# Altium schematic sheet ESC_PCB.SchDoc: BLDC ESC v2
size A; Author: Roel Uytterhoeven
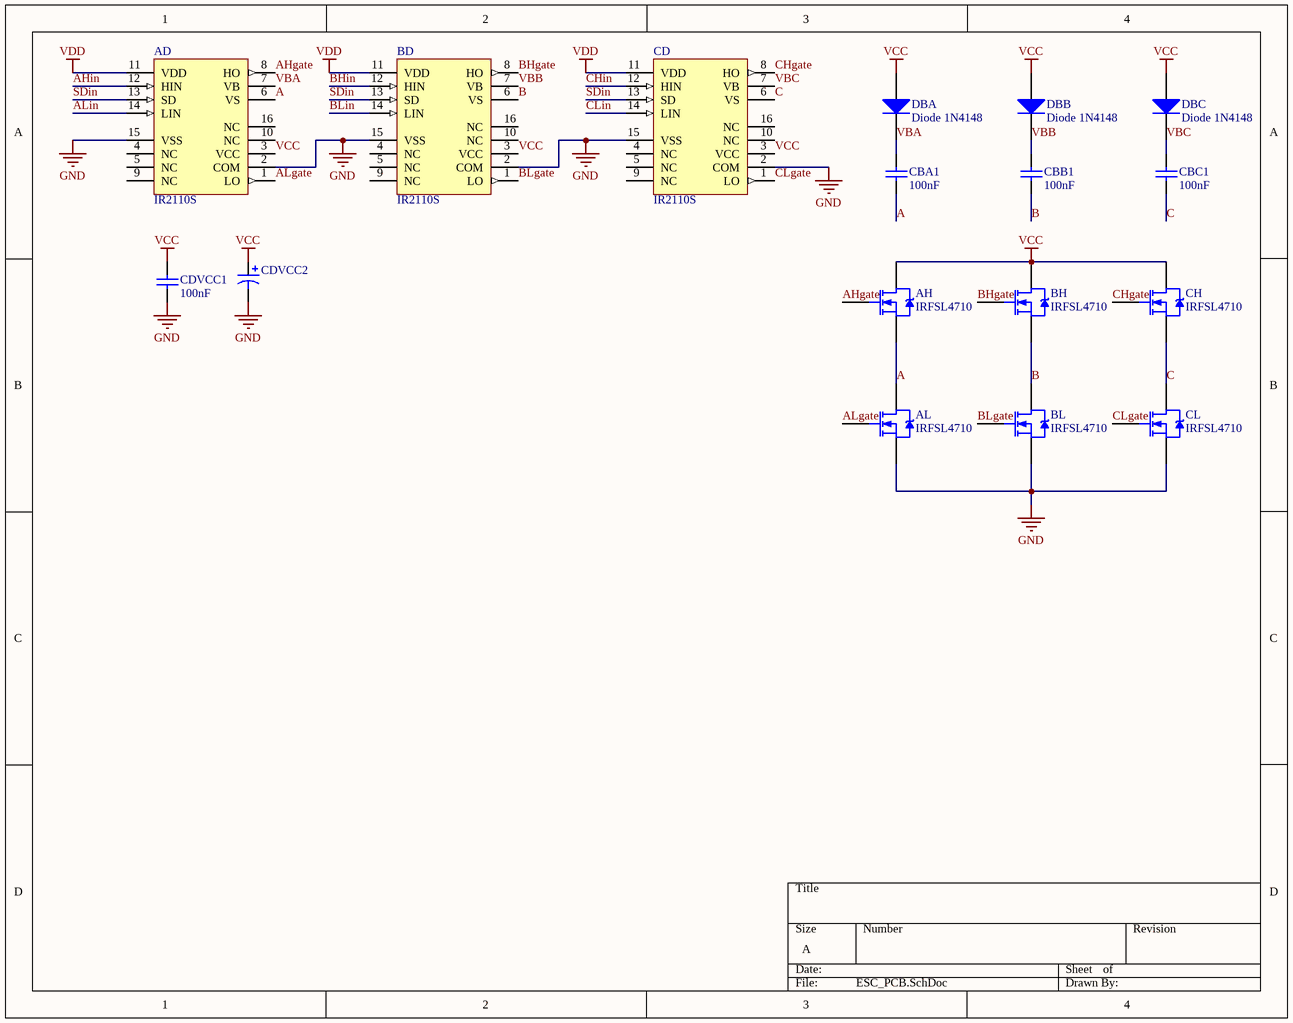
[diagram p0: ESC_PCB.SchDoc]

## Parts
AD  IR2110S  [SOIC16_N]
AH  IRFSL4710  [TO-262]
AL  IRFSL4710  [TO-262]
BD  IR2110S  [SOIC16_N]
BH  IRFSL4710  [TO-262]
BL  IRFSL4710  [TO-262]
CBA1  100nF  [VP31-2.5]
CBB1  100nF  [VP31-2.5]
CBC1  100nF  [VP31-2.5]
CD  IR2110S  [SOIC16_N]
CDVCC1  100nF  [VP31-2.5]
CDVCC2  EKF00MP133J00  [CAPPR2-5X5]  (value not drawn)
CH  IRFSL4710  [TO-262]
CL  IRFSL4710  [TO-262]
DBA  Diode 1N4148  [DO-35]
DBB  Diode 1N4148  [DO-35]
DBC  Diode 1N4148  [DO-35]

## Nets
GND: AD.2(COM) AD.15(VSS) AL.3(S) BD.2(COM) BD.15(VSS) BL.3(S) CD.2(COM) CD.15(VSS) CDVCC1.1 CDVCC2.2 CL.3(S)
VCC: AD.3(VCC) AH.2(D) BD.3(VCC) BH.2(D) CD.3(VCC) CDVCC1.2 CDVCC2.1 CH.2(D) DBA.1(A) DBB.1(A) DBC.1(A)
VDD: AD.11(VDD) BD.11(VDD) CD.11(VDD)
A: AD.6(VS) AH.3(S) AL.2(D) CBA1.1
AHgate: AD.8(HO) AH.1(G)
AHin: AD.12(HIN)
ALgate: AD.1(LO) AL.1(G)
ALin: AD.14(LIN)
B: BD.6(VS) BH.3(S) BL.2(D) CBB1.1
BHgate: BD.8(HO) BH.1(G)
BHin: BD.12(HIN)
BLgate: BD.1(LO) BL.1(G)
BLin: BD.14(LIN)
C: CBC1.1 CD.6(VS) CH.3(S) CL.2(D)
CHgate: CD.8(HO) CH.1(G)
CHin: CD.12(HIN)
CLgate: CD.1(LO) CL.1(G)
CLin: CD.14(LIN)
SDin: AD.13(SD) BD.13(SD) CD.13(SD)
VBA: AD.7(VB) CBA1.2 DBA.2(K)
VBB: BD.7(VB) CBB1.2 DBB.2(K)
VBC: CBC1.2 CD.7(VB) DBC.2(K)

Not connected (* = marked no-connect by the designer): AD 4(NC) 5(NC) 9(NC) 10(NC) 16(NC); BD 4(NC) 5(NC) 9(NC) 10(NC) 16(NC); CD 4(NC) 5(NC) 9(NC) 10(NC) 16(NC)

## Library data of the parts
AD BD CD = IR2110S: High and Low Side Driver; Note: Pins 4, 5, 9, 10 and 16 are not connected; Published: 8-Jun-2000; LatestRevisionDate: 13-Apr-2006; LatestRevisionNote: IPC-7351 Footprint Added.; DatasheetVersion: PD60147J; PackageReference: SOIC16; Publisher: Altium Limited; PackageDescription: 16-Pin Small Outline Integrated Circuit 1.27 mm Pitch; Code_JEDEC: MS-013-AA; Code_IPC: SOIC127P1030-16; ComponentLink1Description: Manufacturer Link; ComponentLink1URL: http://www.irf.com/; ComponentLink2Description: Datasheet; ComponentLink2URL: http://www.irf.com/product-info/datasheets/data/ir2110.pdf
AH AL BH BL CH CL = IRFSL4710: HEXFET Power MOSFET; Note: Pin 2 is electrically connected to Tab (Drain).; Published: 17-Sep-2003; DatasheetVersion: 16-Mar-2001; PackageReference: TO-262; Publisher: Altium Limited; PackageDescription: TO, Thru-Hole, Vertical, Heatsink Mounted; 3 In-Line Leads; Pitch 2.54 mm; ComponentLink1Description: Manufacturer Link; ComponentLink1URL: http://www.irf.com/; ComponentLink2Description: Datasheet; ComponentLink2URL: http://www.irf.com/product-info/datasheets/data/IRFR24N15D.pdf
CBA1 CBB1 CBC1 CDVCC1 = VP31BY103: Dipped Radial Multilayer Ceramic Capacitor X7R: 10nF; Note: See Datasheet for other packages & tolerances; Published: 17-Dec-2003; DatasheetDocument: 4-Feb-2002; PackageDocument: 4-Feb-2002; PackageReference: VP31-2.5; Publisher: Altium Limited; ComponentLink1Description: Manufacturer Link; ComponentLink1URL: http://www.vishay.com/; Value: 10nF
CDVCC2 = EKF00MP133J00: Aluminum Electrolytic Capacitor, Radial Style with Long Leads: 3.3uF, 63V; Note: Refer to Manufacturer's Data Sheets for other lead formations; DrillSize: Nominal, Rounded To The Nearest 0.1mm; Published: 19-Mar-2004; DatasheetDocument: 13-Jan-2000; PackageReference: CAPPR2-5X5; Publisher: Altium Limited; ComponentLink1Description: Manufacturer Link; ComponentLink1URL: http://www.vishay.com/; ComponentLink2Description: Datasheet; ComponentLink2URL: http://www.vishay.com/docs/25004/ekf.pdf; Value: 3.3uF
DBA DBB DBC = Diode 1N4148: High Conductance Fast Diode; Published: 8-Jun-2000; LatestRevisionDate: 17-Jul-2002; LatestRevisionNote: Re-released for DXP Platform.; DatasheetVersion: 1997; PackageReference: DO-35; Publisher: Altium Limited; PackageDescription: Diode, Axial; Body 3.8 x 1.9 mm (LxDia. max), Lead Dia. 0.53 mm (max); Code_JEDEC: DO-204-AH; ComponentLink1Description: Manufacturer Link; ComponentLink1URL: http://www.fairchildsemi.com/; ComponentLink2Description: Datasheet; ComponentLink2URL: http://www.fairchildsemi.com/ds/1N%2F1N4148.pdf